# Altium schematic sheet CanController.SchDoc: CAN Radio Controller
size A4; Author: Vaclav Dvorak; CompanyName: STMicroelectronics; DrawnBy: Vaclav Dvorak; Organization: STMicroelectronics; Address1: Pobrezni 3; Address2: 18600 Prague 8; Address3: Czech Republic; Revision: 0.1; SheetNumber: 1; SheetTotal: 1; PageSetup: Record=PageOptions|CenterHorizontal=True|CenterVertical=True|PrintScale=1.00|XCorrection=1.00|YCorrection=1.00|PrintKind=0|BorderSize=5000000|LeftOffset=0|BottomOffset=0|Orientation=2|PaperLength=1000|PaperWidth=1000|Scale=100|PaperSource=7|PrintQuality=-4|MediaType=1|DitherType=10|PaperKind=A4|PrintScaleMode=1
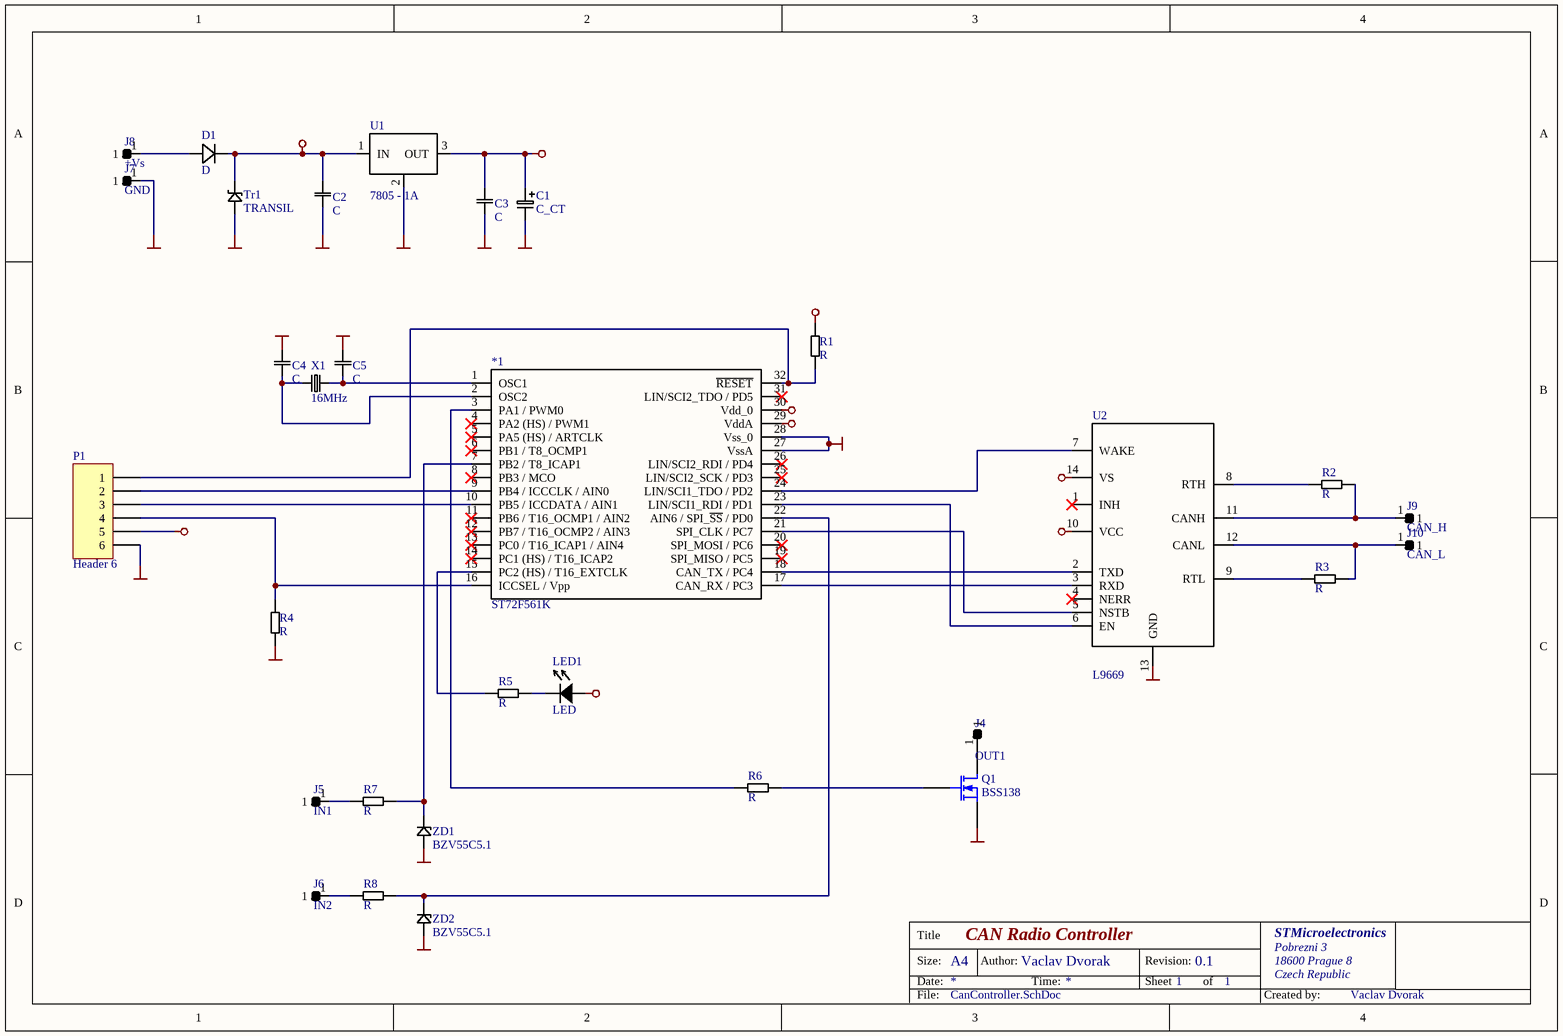
[diagram p0: CanController.SchDoc]

## Parts
*1  ST72F561K  [QFP32]
C1  C_CT  [CTS A]
C2  C  [C0805]
C3  C  [C0805]
C4  C  [C0805]
C5  C  [C0805]
D1  D  [SMA]
J4  OUT1  [PIN]
J5  IN1  [PIN]
J6  IN2  [PIN]
J7  GND  [PIN]
J8  +Vs  [PIN]
J9  CAN_H  [PIN]
J10  CAN_L  [PIN]
LED1  LED  [LED_SMD]
P1  Header 6  [HDR1X6]
Q1  BSS138  [SOT23]
R1  R  [R0805]
R2  R  [R0805]
R3  R  [R0805]
R4  R  [R0805]
R5  R  [R0805]
R6  R  [R0805]
R7  R  [R0805]
R8  R  [R0805]
Tr1  TRANSIL  [SMAJ]
U1  7805 - 1A  [SOT-89]
U2  L9669  [SO14]
X1  16MHz  [HC-49U]
ZD1  BZV55C5.1  [SOD80]
ZD2  BZV55C5.1  [SOD80]

## Nets
+5V: *1.29(VddA) *1.30(Vdd_0) C1.1 C3.2 LED1.1(A) P1.5 R1.2 U1.3(OUT) U2.10(VCC)
GND: *1.27(VssA) *1.28(Vss_0) C1.2 C2.1 C3.1 C4.2 C5.2 J7.1 P1.6 Q1.2(S) R4.2 Tr1.1(A) U1.2(Gnd) U2.13(GND) ZD1.1(A) ZD2.1(A)
Vs: C2.2 D1.2(K) Tr1.2(K) U1.1(IN) U2.14(VS)
Net*1_1: *1.1(OSC1) C5.1 X1.2
Net*1_2: *1.2(OSC2) C4.1 X1.1
Net*1_3: *1.3(PA1_/_PWM0) R6.1
Net*1_7: *1.7(PB2_/_T8_ICAP1) R7.2 ZD1.2(K)
Net*1_9: *1.9(PB4_/_ICCCLK_/_AIN0) P1.2
Net*1_10: *1.10(PB5_/_ICCDATA_/_AIN1) P1.3
Net*1_15: *1.15(PC2_(HS)_/_T16_EXTCLK) R5.2
Net*1_16: *1.16(ICCSEL_/_Vpp) P1.4 R4.1
Net*1_17: *1.17(CAN_RX_/_PC3) U2.3(RXD)
Net*1_18: *1.18(CAN_TX_/_PC4) U2.2(TXD)
Net*1_21: *1.21(SPI_CLK_/_PC7) U2.5(NSTB)
Net*1_22: *1.22(AIN6_/_SPI_~{SS}_/_PD0) R8.2 ZD2.2(K)
Net*1_23: *1.23(LIN/SCI1_RDI_/_PD1) U2.6(EN)
Net*1_24: *1.24(LIN/SCI1_TDO_/_PD2) U2.7(WAKE)
Net*1_32: *1.32(~{RESET}) P1.1 R1.1
NetD1_1: D1.1(A) J8.1
NetJ4_1: J4.1 Q1.3(D)
NetJ5_1: J5.1 R7.1
NetJ6_1: J6.1 R8.1
NetJ9_1: J9.1 R2.1 U2.11(CANH)
NetJ10_1: J10.1 R3.1 U2.12(CANL)
NetLED1_2: LED1.2(K) R5.1
NetQ1_1: Q1.1(G) R6.2
NetR2_2: R2.2 U2.8(RTH)
NetR3_2: R3.2 U2.9(RTL)

Not connected (* = marked no-connect by the designer): *1 4(PA2_(HS)_/_PWM1)* 5(PA5_(HS)_/_ARTCLK)* 6(PB1_/_T8_OCMP1)* 8(PB3_/_MCO)* 11(PB6_/_T16_OCMP1_/_AIN2)* 12(PB7_/_T16_OCMP2_/_AIN3)* 13(PC0_/_T16_ICAP1_/_AIN4)* 14(PC1_(HS)_/_T16_ICAP2)* 19(SPI_MISO_/_PC5)* 20(SPI_MOSI_/_PC6)* 25(LIN/SCI2_SCK_/_PD3)* 26(LIN/SCI2_RDI_/_PD4)* 31(LIN/SCI2_TDO_/_PD5)*; U2 1(INH)* 4(NERR)*

## Notes on the sheet
- Title
- Size:
- Date:
- A4
- Author:
- Time:
- Revision:
- Sheet
- of
- File:
- Created by:

## Library data of the parts
J4-J10 = PIN
P1 = Header 6: Header, 6-Pin; LatestRevisionDate: 17-Jul-2002; LatestRevisionNote: Re-released for DXP Platform.; Publisher: Altium Limited
Q1 = BSS138: N-Channel Enhancement Mode Vertical DMOS FET; Package Information: Latest Revision: 1996; Published: 17-Dec-2003; Datasheet: Latest Revision: Mar-96; Package Reference: SOT23; Publisher: Altium Limited
X1 = XTALL
ZD1 ZD2 = ZD